# Altium schematic sheet nfc-epd-sensors.SchDoc
size A
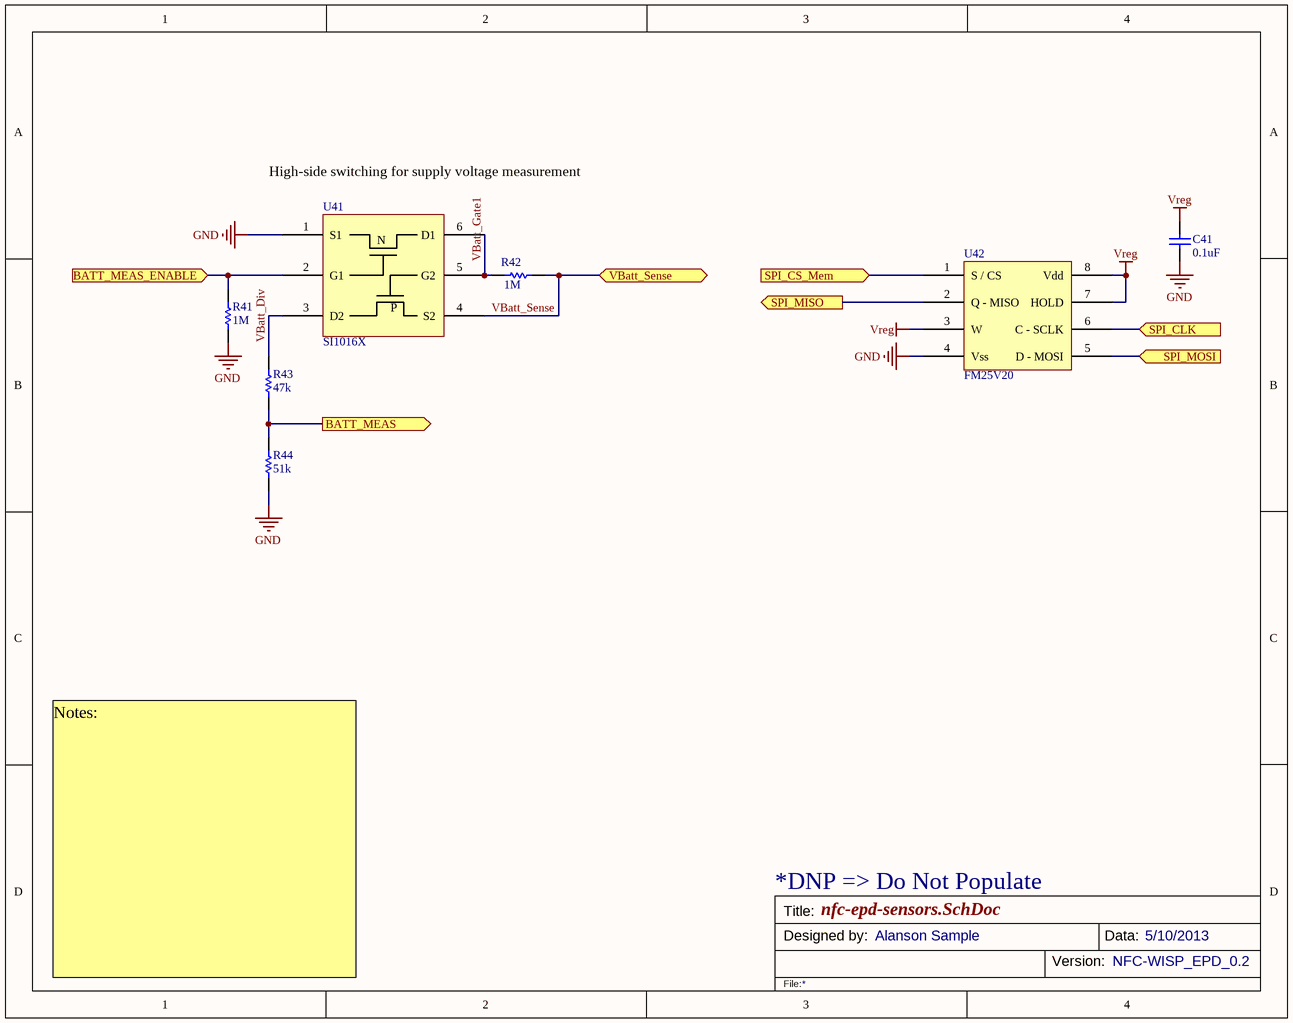
[diagram p0: nfc-epd-sensors.SchDoc]

## Parts
C41  value 0.1uF  [0603]  (hidden comment: Cap)
R41  value 1M  [0603]  (hidden comment: Res)
R42  value 1M  [0603]  (hidden comment: Res)
R43  value 47k  [0603]  (hidden comment: Res)
R44  value 51k  [0603]  (hidden comment: Res)
U41  SI1016X  [SC-89-6 Vishay]
U42  FM25V20  [TDFN-8]

## Ports
BATT_MEAS (out), BATT_MEAS_ENABLE (in), SPI_CLK (in), SPI_CS_Mem (in), SPI_MISO (out), SPI_MOSI (in), VBatt_Sense

## Nets
GND: C41.1 R41.1 R44.1 U41.1(S1) U42.4(Vss)
Vreg: C41.2 U42.3(W) U42.7(HOLD) U42.8(Vdd)
BATT_MEAS: R43.1 R44.2 ; port BATT_MEAS
BATT_MEAS_ENABLE: R41.2 U41.2(G1) ; port BATT_MEAS_ENABLE
SPI_CLK: U42.6(C_-_SCLK) ; port SPI_CLK
SPI_CS_Mem: U42.1(S_/_CS) ; port SPI_CS_Mem
SPI_MISO: U42.2(Q_-_MISO) ; port SPI_MISO
SPI_MOSI: U42.5(D_-_MOSI) ; port SPI_MOSI
VBatt_Div: R43.2 U41.3(D2)
VBatt_Gate1: R42.2 U41.5(G2) U41.6(D1)
VBatt_Sense: R42.1 U41.4(S2) ; port VBatt_Sense

## Notes on the sheet
- High-side switching for supply voltage measurement
- *DNP => Do Not Populate
- Notes:
- Title:
- Designed by:
- Alanson Sample
- Version:
- Data:
- NFC-WISP_EPD_0.2
- 5/10/2013
- File:
- (in symbol SI1016X) N; P

## Library data of the parts
C41 = Cap: Ceramic Capacitor (Surface Mount); Manufacturer: Generic Ceramic Chip Cap (TBD); Digi-Key Part Number: *; Manufacturer Part Number: *; Note: *; Rating: *
R41-R44 = Res: Chip Resistor (Surface Mount); Manufacturer: Generic Chip Res (TBD); Manufacturer Part Number: *; Digi-Key Part Number: *; Rating: *
U41 = SI1016X: NMOS and PMOS array; Manufacturer: Vishay Siliconix; Manufacturer Part Number: SI1016X-T1-GE3; Digi-Key Part Number: SI1016X-T1-GE3CT-ND; Note: *; Value: *; Rating: *
U42 = FM25V20: 2 Mbit FRAM SPI; Manufacturer: Cypress Semiconductor Corp; Digi-Key Part Number: 428-3214-ND; Manufacturer Part Number: FM25V20; Rating: *; Note: *; Value: *